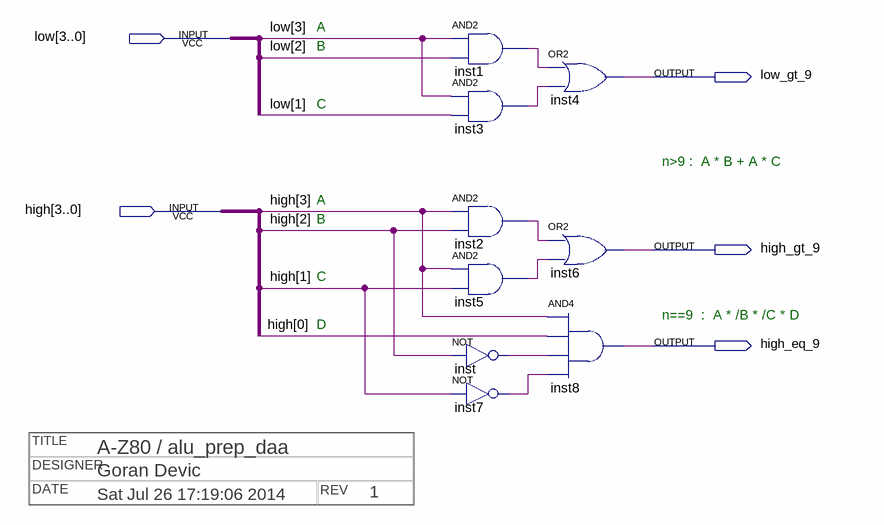
[diagram p0: schematic sheet]
// Quartus schematic alu_prep_daa.bdf as structural Verilog: 9 symbols, 5 pins
// Title block: DATE: Sat Jul 26 17:19:06 2014; DESIGNER: Goran Devic; REV: 1; TITLE: A-Z80 / alu_prep_daa
module alu_prep_daa (
  input  [3:0] low,
  input  [3:0] high,
  output low_gt_9,
  output high_gt_9,
  output high_eq_9
);

  wire inst1_out, inst2_out, inst3_out, inst5_out, inst7_out, inst_out;

  and inst1 (inst1_out, low[3], low[2]);
  and inst3 (inst3_out, low[3], low[1]);
  and inst2 (inst2_out, high[3], high[2]);
  and inst5 (inst5_out, high[3], high[1]);
  not inst (inst_out, high[2]);
  not inst7 (inst7_out, high[1]);
  or inst4 (low_gt_9, inst1_out, inst3_out);
  or inst6 (high_gt_9, inst2_out, inst5_out);
  and inst8 (high_eq_9, high[3], high[0], inst_out, inst7_out);

  // Notes on the sheet:
  //   A
  //   B
  //   C
  //   n>9 :  A * B + A * C
  //   A
  //   B
  //   C
  //   n==9  :  A * /B * /C * D
  //   D
endmodule
